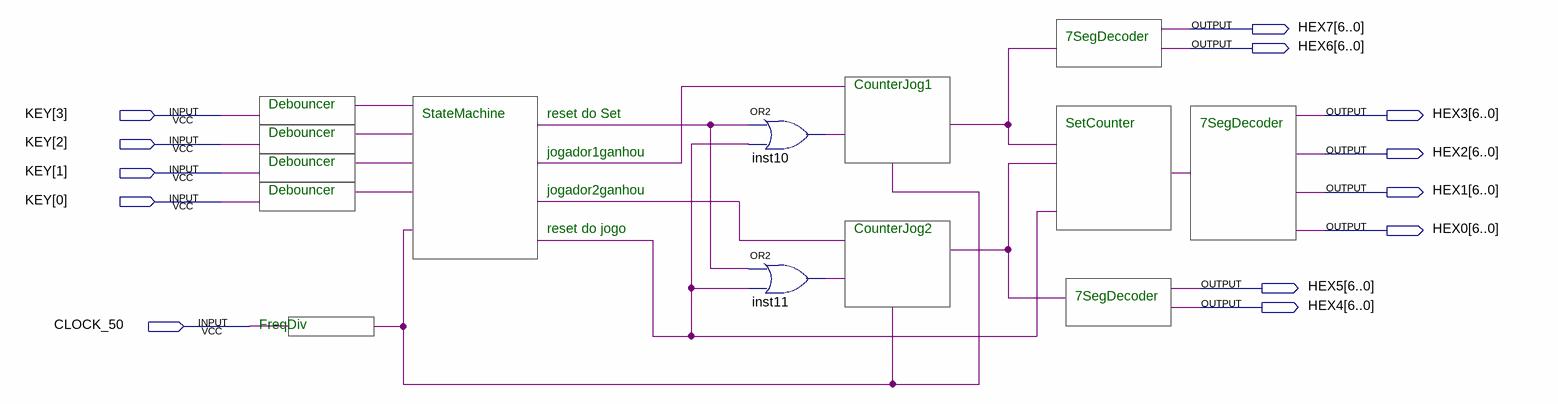
[diagram p0: schematic sheet]
// Quartus schematic desenho do projeto.bdf as structural Verilog: 2 symbols, 13 pins
module \desenho_do_projeto  (
  input  [3:0] KEY,
  input  CLOCK_50,
  output [6:0] HEX7,
  output [6:0] HEX6,
  output [6:0] HEX3,
  output [6:0] HEX2,
  output [6:0] HEX1,
  output [6:0] HEX0,
  output [6:0] HEX5,
  output [6:0] HEX4
);

  wire inst10_out, inst11_out, undriven, undriven_2;

  or inst10 (inst10_out, undriven_2, undriven);
  or inst11 (inst11_out, undriven_2, undriven);

  // Notes on the sheet:
  //   7SegDecoder
  //   CounterJog1
  //   Debouncer
  //   StateMachine
  //   reset do Set
  //   SetCounter
  //   7SegDecoder
  //   Debouncer
  //   jogador1ganhou
  //   Debouncer
  //   Debouncer
  //   jogador2ganhou
  //   reset do jogo
  //   CounterJog2
  //   7SegDecoder
  //   FreqDiv
endmodule
